# Altium schematic sheet Micro & LCD.SchDoc
size A3
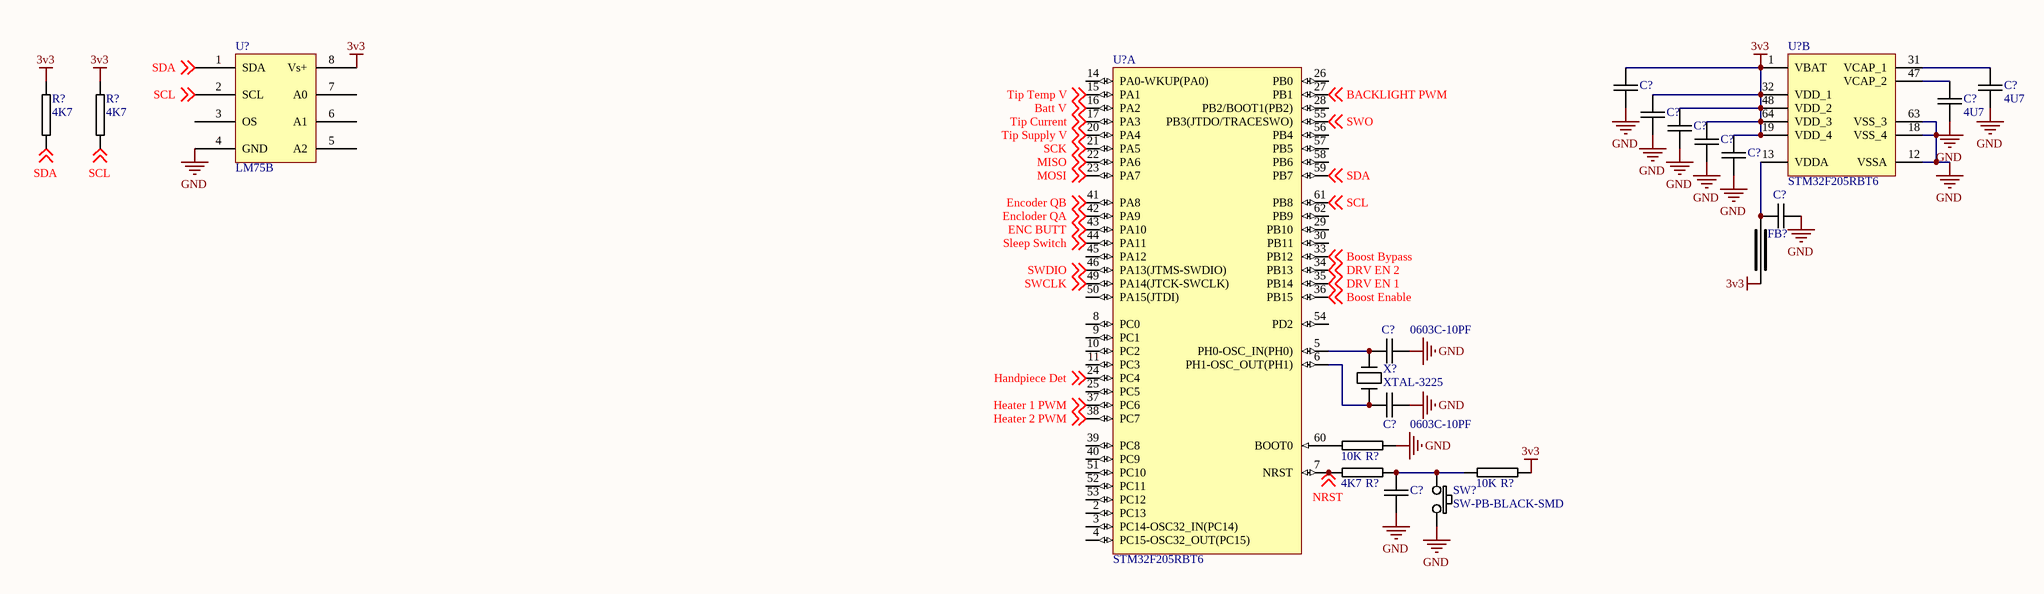
[diagram p0: Micro & LCD.SchDoc]

## Parts
(Parts that share a designator on the sheet are numbered #1, #2 ... from top to bottom, then left to right.)
C?#1  0603C-100N-35V-X5R  [0603C-GENERIC]  (value not drawn)
C?#2  4U7  [1206C-GENERIC]
C?#3  4U7  [1206C-GENERIC]
C?#4  0603C-100N-35V-X5R  [0603C-GENERIC]  (value not drawn)
C?#5  0603C-100N-35V-X5R  [0603C-GENERIC]  (value not drawn)
C?#6  0603C-100N-35V-X5R  [0603C-GENERIC]  (value not drawn)
C?#7  0603C-100N-35V-X5R  [0603C-GENERIC]  (value not drawn)
C?#8  0603C-100N-35V-X5R  [0603C-GENERIC]  (value not drawn)
C?#9  0603C-10PF  [0603C-GENERIC]
C?#10  0603C-10PF  [0603C-GENERIC]
C?#11  0603C-100N-35V-X5R  [0603C-GENERIC]  (value not drawn)
FB?  0603FB-GENERIC  [0603FB-GENERIC]  (value not drawn)
R?#1  4K7  [0603R-4K7]
R?#2  4K7  [0603R-4K7]
R?#3  10K  [0603R-10K]
R?#4  4K7  [0603R-4K7]
R?#5  10K  [0603R-10K]
SW?  SW-PB-BLACK-SMD  [SW-PB-SMD]
U?#1  STM32F205RBT6  [STM-LQFP64_N]  (part B of 2)
U?#2  STM32F205RBT6  [STM-LQFP64_N]  (part A of 2)
U?#3  LM75B  [SO8]
X?  XTAL-3225  [XTAL-3225]

## Nets
3v3: C?#1.1 C?#4.1 C?#5.1 C?#6.1 C?#7.1 FB?.1 R?#1.1 R?#2.1 R?#5.2 U?#1.1(VBAT) U?#1.19(VDD_4) U?#1.32(VDD_1) U?#1.48(VDD_2) U?#1.64(VDD_3) U?#3.8(Vs+)
GND: C?#1.2 C?#2.2 C?#3.2 C?#4.2 C?#5.2 C?#6.2 C?#7.2 C?#8.2 C?#9.2 C?#10.2 C?#11.2 R?#3.2 SW?.2 U?#1.12(VSSA) U?#1.18(VSS_4) U?#1.63(VSS_3) U?#3.4(GND)
BACKLIGHT PWM: U?#2.27(PB1) ; off-sheet BACKLIGHT PWM
Batt V: U?#2.16(PA2) ; off-sheet Batt V
Boost Bypass: U?#2.33(PB12) ; off-sheet Boost Bypass
Boost Enable: U?#2.36(PB15) ; off-sheet Boost Enable
DRV EN 1: U?#2.35(PB14) ; off-sheet DRV EN 1
DRV EN 2: U?#2.34(PB13) ; off-sheet DRV EN 2
ENC BUTT: U?#2.43(PA10) ; off-sheet ENC BUTT
Encloder QA: U?#2.42(PA9) ; off-sheet Encloder QA
Encoder QB: U?#2.41(PA8) ; off-sheet Encoder QB
Handpiece Det: U?#2.24(PC4) ; off-sheet Handpiece Det
Heater 1 PWM: U?#2.37(PC6) ; off-sheet Heater 1 PWM
Heater 2 PWM: U?#2.38(PC7) ; off-sheet Heater 2 PWM
MISO: U?#2.22(PA6) ; off-sheet MISO
MOSI: U?#2.23(PA7) ; off-sheet MOSI
NRST: R?#4.1 U?#2.7(NRST) ; off-sheet NRST
SCK: U?#2.21(PA5) ; off-sheet SCK
SCL: R?#2.2 U?#2.61(PB8) U?#3.2(SCL) ; off-sheet SCL
SDA: R?#1.2 U?#2.59(PB7) U?#3.1(SDA) ; off-sheet SDA
Sleep Switch: U?#2.44(PA11) ; off-sheet Sleep Switch
SWCLK: U?#2.49(PA14(JTCK-SWCLK)) ; off-sheet SWCLK
SWDIO: U?#2.46(PA13(JTMS-SWDIO)) ; off-sheet SWDIO
SWO: U?#2.55(PB3(JTDO/TRACESWO)) ; off-sheet SWO
Tip Current: U?#2.17(PA3) ; off-sheet Tip Current
Tip Supply V: U?#2.20(PA4) ; off-sheet Tip Supply V
Tip Temp V: U?#2.15(PA1) ; off-sheet Tip Temp V
NetC?#2_1: C?#2.1 U?#1.31(VCAP_1)
NetC?#3_1: C?#3.1 U?#1.47(VCAP_2)
NetC?#8_1: C?#8.1 FB?.2 U?#1.13(VDDA)
NetC?#9_1: C?#9.1 U?#2.5(PH0-OSC_IN(PH0)) X?.1
NetC?#10_1: C?#10.1 U?#2.6(PH1-OSC_OUT(PH1)) X?.3
NetC?#11_1: C?#11.1 R?#4.2 R?#5.1 SW?.1
NetR?#3_1: R?#3.1 U?#2.60(BOOT0)

Not connected (* = marked no-connect by the designer): U?#2 2(PC13) 3(PC14-OSC32_IN(PC14)) 4(PC15-OSC32_OUT(PC15)) 8(PC0) 9(PC1) 10(PC2) 11(PC3) 14(PA0-WKUP(PA0)) 25(PC5) 26(PB0) 28(PB2/BOOT1(PB2)) 29(PB10) 30(PB11) 39(PC8) 40(PC9) 45(PA12) 50(PA15(JTDI)) 51(PC10) 52(PC11) 53(PC12) 54(PD2) 56(PB4) 57(PB5) 58(PB6) 62(PB9); U?#3 3(OS) 5(A2) 6(A1) 7(A0)

## Library data of the parts
C?#1 C?#4-C?#8 C?#11 = 0603C-100N-35V-X5R: CAPACITOR 0603 CERAMIC
C?#2 C?#3 = 1206C-4U7-50V: CAPACITOR 1206 CERAMIC
C?#9 C?#10 = 0603C-10PF: CAPACITOR 0603 CERAMIC
FB? = 0603FB-GENERIC: FERRITE BEAD SMD
R?#1 R?#2 R?#4 = 0603R-4K7: GENERIC RESISTOR 0603; Manufacturer: Stackpole Electronics Inc; Manufacturer Part Number: RMCF 1/16 4.7K 1% R; Reel: R23; Supplier 1: Digi-Key; Supplier Part Number 1: RMCF0603FT4K70TR-ND
R?#3 R?#5 = 0603R-10K: GENERIC RESISTOR 0603; Manufacturer: Stackpole Electronics Inc; Manufacturer Part Number: RMCF 1/16 10K 1% R; Tolerance: ±1%; Power (Watts): 0.1W, 1/10W; Temperature Coefficient: ±100ppm/°C; Resistance In Ohms: 10.0K; Reel: R21; Category: Resistors; Supplier Part Number: RMCF1/1610KFRDKR-ND; Lead Style: Surface Mount (SMD - SMT); RoHS: RoHS Compliant; Packaging: Digi-Reel®; Case: 0603 (1608 metric); Composition: Thick Film; Supplier: Digi-Key; Supplier 1: Digi-Key; Supplier Part Number 1: RMCF0603FT10K0DKR-ND
SW? = SW-PB-BLACK-SMD: PUSHBUTTON SWITCH 6MM SMD
U?#1 U?#2 = STM32F205RBT6: ARM Cortex-M3 32-bit MCU, 128 KB Flash, 64 KB Internal RAM, 51 I/Os, 64-pin LQFP, -40 to 85 degC, Tray; D/A Converter: 2x12-bit (2 Channel); FLASH Size (Prog) (kB): 128; I/Os (High Current): 51; Internal RAM Size (kB): 64; Operating Frequency(F) (Processor speed) (MHz): 120; Supply Voltage(Vcc) min (V): 1.8; DatasheetVersion: Rev. 9; PackageVersion: Rev. 4, 06/2013; PackageReference: LQFP64; PackageDescription: 64-Pin Low Profile Quad Flat Package, 10 x 10 mm Body, 0.5 mm Pitch; Supplier 1: Digi-Key; Supplier Part Number 1: 497-11153-ND; Supplier 2: Farnell; Supplier Part Number 2: 2060895; Supplier 3: Newark; Supplier Part Number 3: 47T9327; Core: ARM Cortex-M3; Packing: Tray; Mounting Technology: Surface Mount; PartNumber: STM32F205RBT6; ComponentLink1Description: Manufacturer URL; ComponentLink1URL: http://www.st.com/web/en/home.html; ComponentLink2Description: Datasheet; ComponentLink2URL: http://www.st.com/st-web-ui/static/active/en/resource/technical/document/datasheet/CD00237391.pdf; ComponentLink3Description: Package Specification; ComponentLink3URL: http://www.st.com/st-web-ui/static/active/en/resource/technical/document/datasheet/DM00037051.pdf
U?#3 = LM75B: Integrated I2C Temperature Sensor
X? = XTAL-3225: GENERIC 3225 CRYSTAL